# Altium schematic sheet LAN7800-I-VSX_2026-06-13.schdoc
size 105 x 88 mm
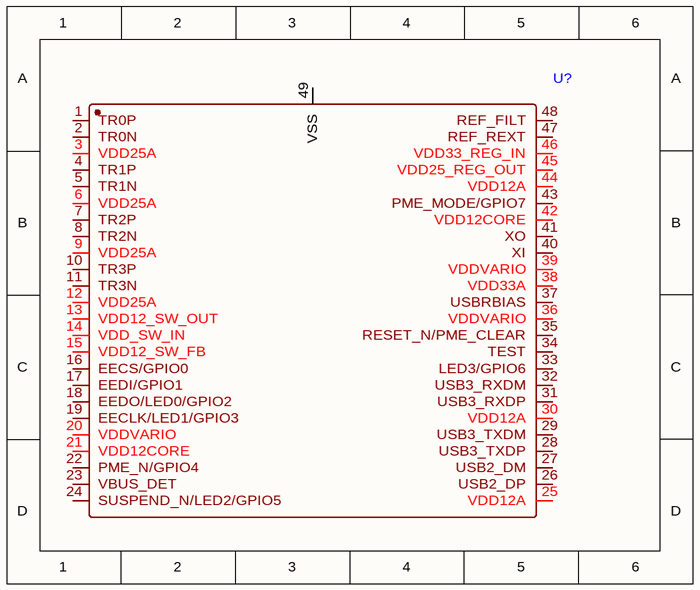
[diagram p0: LAN7800-I-VSX_2026-06-13.schdoc]

## Parts
U?  (no value)  [QFN-48_L6.0-W6.0-P0.40-TL-EP4.2]

## Nets

Not connected (* = marked no-connect by the designer): U? 1(TR0P) 2(TR0N) 3(VDD25A) 4(TR1P) 5(TR1N) 6(VDD25A) 7(TR2P) 8(TR2N) 9(VDD25A) 10(TR3P) 11(TR3N) 12(VDD25A) 13(VDD12_SW_OUT) 14(VDD_SW_IN) 15(VDD12_SW_FB) 16(EECS/GPIO0) 17(EEDI/GPIO1) 18(EEDO/LED0/GPIO2) 19(EECLK/LED1/GPIO3) 20(VDDVARIO) 21(VDD12CORE) 22(PME_N/GPIO4) 23(VBUS_DET) 24(SUSPEND_N/LED2/GPIO5) 25(VDD12A) 26(USB2_DP) 27(USB2_DM) 28(USB3_TXDP) 29(USB3_TXDM) 30(VDD12A) 31(USB3_RXDP) 32(USB3_RXDM) 33(LED3/GPIO6) 34(TEST) 35(RESET_N/PME_CLEAR) 36(VDDVARIO) 37(USBRBIAS) 38(VDD33A) 39(VDDVARIO) 40(XI) 41(XO) 42(VDD12CORE) 43(PME_MODE/GPIO7) 44(VDD12A) 45(VDD25_REG_OUT) 46(VDD33_REG_IN) 47(REF_REXT) 48(REF_FILT) 49(VSS)

## Library data of the parts
U? = LAN7800-I/VSX